# Altium schematic sheet MCU-io.SchDoc
size A4
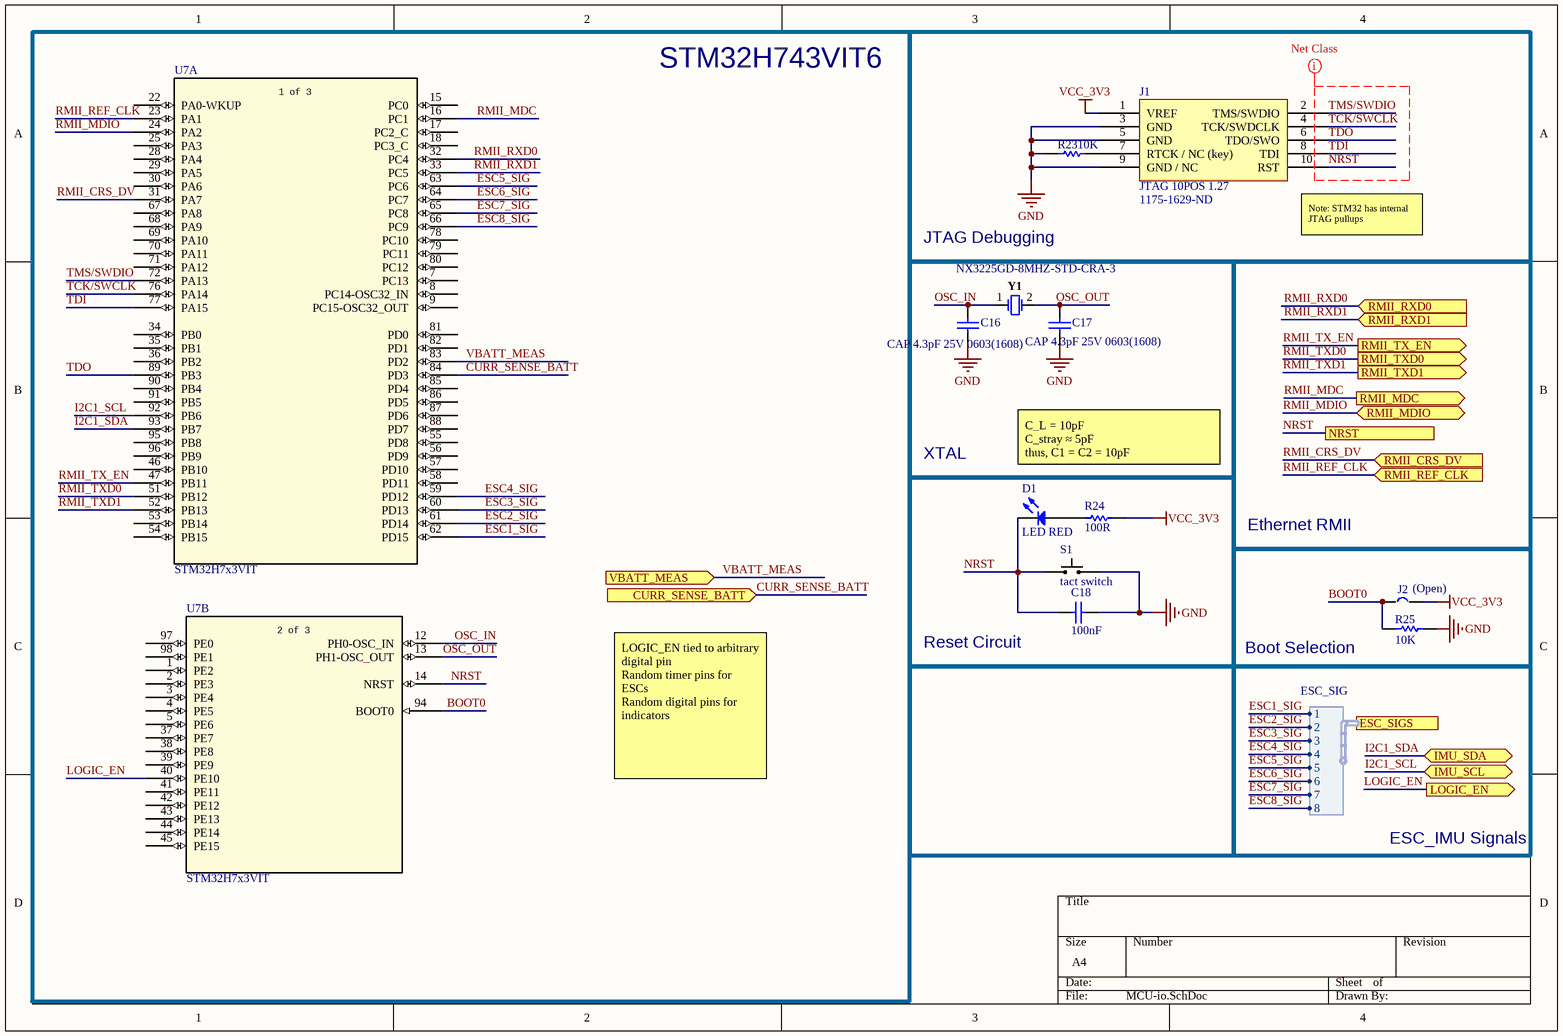
[diagram p0: MCU-io.SchDoc]

## Parts
C16  CAP 4.3pF 25V 0603(1608)  [CAPC0603(1608)100_L]
C17  CAP 4.3pF 25V 0603(1608)  [CAPC0603(1608)100_L]
C18  100nF  [CAPC0603(1608)100_N]
D1  LED RED  [LED_0805]
J1  JTAG 10POS 1.27  Supplier Part Number 1: 1175-1629-ND  [5x2 JTAG SMD]
J2  (Open)  [Solder Jumper]
R23  10K  [RESC0603(1608)_N]
R24  100R  [RESC0603(1608)_L]
R25  10K  [RESC0603(1608)_N]
S1  tact switch  [EVP-AA202K]
U7  STM32H7x3VIT  [LQFP100-14x14mm]  (parts A,B of 3)
Y1  NX3225GD-8MHZ-STD-CRA-3  [NDK-NX3225GD-8MHZ-STD-CRA-3_V]

## Blocks framed on the sheet
STM32H743VIT6: U7
JTAG Debugging: J1 R23

## Ports
CURR_SENSE_BATT (in), ESC_SIGS (harness ESC_SIG), IMU_SCL (bidir), IMU_SDA (bidir), LOGIC_EN (out), NRST, RMII_CRS_DV (in), RMII_MDC (out), RMII_MDIO (bidir), RMII_REF_CLK (in), RMII_RXD0 (in), RMII_RXD1 (in), RMII_TX_EN (out), RMII_TXD0 (out), RMII_TXD1 (out), VBATT_MEAS (in)

## Harnesses
ESC_SIG: 1, 2, 3, 4, 5, 6, 7, 8

## Nets
GND: C16.1 C17.1 C18.1 J1.3(GND) J1.5(GND) J1.9(GND_/_NC) R23.1 R25.2 S1.2
VCC_3V3: J1.1(VREF) J2.2 R24.2
BOOT0: J2.1 R25.1 U7.94(BOOT0)
CURR_SENSE_BATT: U7.84(PD3) ; port CURR_SENSE_BATT
ESC1_SIG: U7.62(PD15) ; port ESC_SIGS.1
ESC2_SIG: U7.61(PD14) ; port ESC_SIGS.2
ESC3_SIG: U7.60(PD13) ; port ESC_SIGS.3
ESC4_SIG: U7.59(PD12) ; port ESC_SIGS.4
ESC5_SIG: U7.63(PC6) ; port ESC_SIGS.5
ESC6_SIG: U7.64(PC7) ; port ESC_SIGS.6
ESC7_SIG: U7.65(PC8) ; port ESC_SIGS.7
ESC8_SIG: U7.66(PC9) ; port ESC_SIGS.8
I2C1_SCL: U7.92(PB6) ; port IMU_SCL
I2C1_SDA: U7.93(PB7) ; port IMU_SDA
LOGIC_EN: U7.40(PE10) ; port LOGIC_EN
NRST: C18.2 D1.1(K) J1.10(RST) S1.1 U7.14(NRST) ; port NRST
OSC_IN: C16.2 U7.12(PH0-OSC_IN) Y1.1
OSC_OUT: C17.2 U7.13(PH1-OSC_OUT) Y1.2
RMII_CRS_DV: U7.31(PA7) ; port RMII_CRS_DV
RMII_MDC: U7.16(PC1) ; port RMII_MDC
RMII_MDIO: U7.24(PA2) ; port RMII_MDIO
RMII_REF_CLK: U7.23(PA1) ; port RMII_REF_CLK
RMII_RXD0: U7.32(PC4) ; port RMII_RXD0
RMII_RXD1: U7.33(PC5) ; port RMII_RXD1
RMII_TX_EN: U7.47(PB11) ; port RMII_TX_EN
RMII_TXD0: U7.51(PB12) ; port RMII_TXD0
RMII_TXD1: U7.52(PB13) ; port RMII_TXD1
TCK/SWCLK: J1.4(TCK/SWDCLK) U7.76(PA14)
TDI: J1.8(TDI) U7.77(PA15)
TDO: J1.6(TDO/SWO) U7.89(PB3)
TMS/SWDIO: J1.2(TMS/SWDIO) U7.72(PA13)
VBATT_MEAS: U7.83(PD2) ; port VBATT_MEAS
NetD1_2: D1.2(A) R24.1
NetJ1_7: J1.7(RTCK_/_NC_(key)) R23.2

Not connected (* = marked no-connect by the designer): U7 1(PE2) 2(PE3) 3(PE4) 4(PE5) 5(PE6) 7(PC13) 8(PC14-OSC32_IN) 9(PC15-OSC32_OUT) 15(PC0) 17(PC2_C) 18(PC3_C) 22(PA0-WKUP) 25(PA3) 28(PA4) 29(PA5) 30(PA6) 34(PB0) 35(PB1) 36(PB2) 37(PE7) 38(PE8) 39(PE9) 41(PE11) 42(PE12) 43(PE13) 44(PE14) 45(PE15) 46(PB10) 53(PB14) 54(PB15) 55(PD8) 56(PD9) 57(PD10) 58(PD11) 67(PA8) 68(PA9) 69(PA10) 70(PA11) 71(PA12) 78(PC10) 79(PC11) 80(PC12) 81(PD0) 82(PD1) 85(PD4) 86(PD5) 87(PD6) 88(PD7) 90(PB4) 91(PB5) 95(PB8) 96(PB9) 97(PE0) 98(PE1)

## Layout directives
net class JTAG: NRST, TCK/SWCLK, TDI, TDO, TMS/SWDIO

## Notes on the sheet
- (near J1) Note: STM32 has internal JTAG pullups
- XTAL
- C_L = 10pF
  C_stray ≈ 5pF
  thus, C1 = C2 = 10pF
- Ethernet RMII
- Reset Circuit
- Boot Selection
- LOGIC_EN tied to arbitrary digital pin
  Random timer pins for ESCs
  Random digital pins for indicators
- ESC_IMU Signals
- (in symbol STM32H7x3VIT, part A) 1 of 3
- (in symbol STM32H7x3VIT, part B) 2 of 3

## Library data of the parts
C16 C17 = CMP-1035-00303-1: CAP 4.3pF 25V ±0.5pF 0603 (1608 Metric) Thickness 1mm SMD; Case-EIA: 0603; Tolerance: Â±0.5pF; Case-Metric: 1608; Value: 4.3pF; Technology: SMT; Max Thickness: 1 mm; Rated Voltage: 25 V
C18 = CMP-1035-02580-1: CAP 100nF 10V ±10% 0603 (1608 Metric) Thickness 1mm SMD; Tolerance: Â±10%; Case-EIA: 0603; Case-Metric: 1608; Max Thickness: 1 mm; Value: 100nF; Rated Voltage: 10 V; Technology: SMT
D1 = LED0: led; Manufacturer: Lite-On Inc.; Manufacturer Part Number: LTST-C171KRKT; Lens Color: Colorless; Lens Transparency: Clear; Millicandela Rating: 54mcd; Lens Style/Size: Rectangle with Flat Top, 1.40mm x 1.25mm; Voltage - Forward (Vf) (Typ): 2V; Current - Test: 20mA; Viewing Angle: 130°; Wavelength - Dominant: 631nm; Wavelength - Peak: 639nm; Supplier 1: Digi-Key; Supplier Part Number 1: 160-1427-1-ND; RoHS: RoHS Compliant; Category: Optoelectronics; Stock 1: 260544; Pricing 1: 1=0.31, 10=0.225, 25=0.1656, 100=0.1183, 250=0.0804, 500=0.07096, 1000=0.05558 (USD); Packaging: Cut Tape (CT); Part Status: Active; Color: Red; Mounting Type: Surface Mount; Features: -; Package / Case: 0805 (2012 Metric); Size / Dimension: 2.00mm L x 1.25mm W; Height (Max): 0.80mm; ComponentLink1URL: http://optoelectronics.liteon.com/upload/download/DS22-2000-109/LTST-C171KRKT.pdf; ComponentLink1Description: http://optoelectronics.liteon.com/upload/download/DS22-2000-109/LTST-C171KRKT.pdf
J1 = jtag 10pos mini: Supplier 1: Digi-Key
J2 = Jumper
R23 R25 = CMP-1012-00098-1: 10K 0.1W 5% 0603 (1608 Metric)  SMD; Case-EIA: 0603; Value: 10000.00 Ohm; Case-Metric: 1608; Technology: SMT; Tolerance: 5 %; Power: 0.1 W
R24 = CMP-1012-00050-1: 100R 0.1W 5% 0603 (1608 Metric)  SMD; Case-EIA: 0603; Value: 100.00 Ohm; Case-Metric: 1608; Tolerance: 5 %; Technology: SMT; Power: 0.1 W
S1 = EVP-AA Switch: EVP-AA Momentary Switch SPST-NO; Part Number: EVP-AA202K; Supplier 1: Digi-Key; Supplier Part Number 1: P13348SCT-ND; Datasheet: http://industrial.panasonic.com/lecs/www-data/pdf/ATK0000/ATK0000CE26.pdf
U7 = STM32H7x3VIT: Imported; Vendor: STMicroelectronics; Copyright: Copyright (C) 2016 Accelerated Designs. All rights reserved; Manufacturer_Part_Number: stm32h7x3vit; RefDes: RefDes; Type: DEV; Value: Value
Y1 = CMP-2000-07595-1: Crystal Unit, 8 MHz, 8 pF, -40 to 150 degC, 2-Pin SMD, RoHS, Tape and Reel; Manufacturer: NDK; Load Capacitance: 8pF; ESR (Equivalent Series Resistance): 500Ohm; Frequency Tolerance: 50ppm; Frequency Stability: 150ppm; Frequency: 8MHz; Case/Package: SMD/SMT; Datasheet Version: 11/2016; Min Operating Temperature: -40degC; Packaging: TapeandReel; Width: 0.098inch; Package Quantity: 3000; Number of Pins: 2; Package Description: 2-Pin Surface Mount Device, Body 3.2 x 2.5 mm; RoHSCompliant: True; Package Reference: NX3225GD-8MHZ-STD-CRA-3; Datasheet URL: http://www.ndk.com/images/products/catalog/c_NX3225GD-STD-CRA-3_e.pdf; Mounting Technology: SurfaceMount; Length: 0.126inch; Mount: SurfaceMount; Manufacturer URL: http://www.ndk.com/en/; Max Operating Temperature: 150degC; Height: 0.039inch